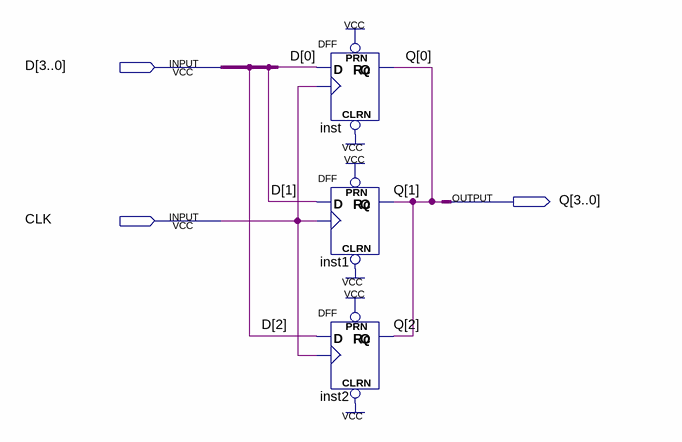
[diagram p0: schematic sheet]
// Quartus schematic dff3.bdf as structural Verilog: 3 symbols, 3 pins
module dff3 (
  input  [3:0] D,
  input  CLK,
  output [3:0] Q
);

  DFF inst (.CLRN(1'b1), .CLK(CLK), .D(D[0]), .PRN(1'b1), .Q({2{Q[2]}}));
  DFF inst1 (.CLRN(1'b1), .CLK(CLK), .D(D[1]), .PRN(1'b1), .Q({2{Q[2]}}));
  DFF inst2 (.CLRN(1'b1), .CLK(CLK), .D(D[2]), .PRN(1'b1), .Q({2{Q[2]}}));

  assign Q[1:0] = {2{Q[2]}};
endmodule
